# Altium schematic sheet FINAL_Prototype_Circuit.SchDoc
size A; SheetNumber: 2; SheetTotal: 2
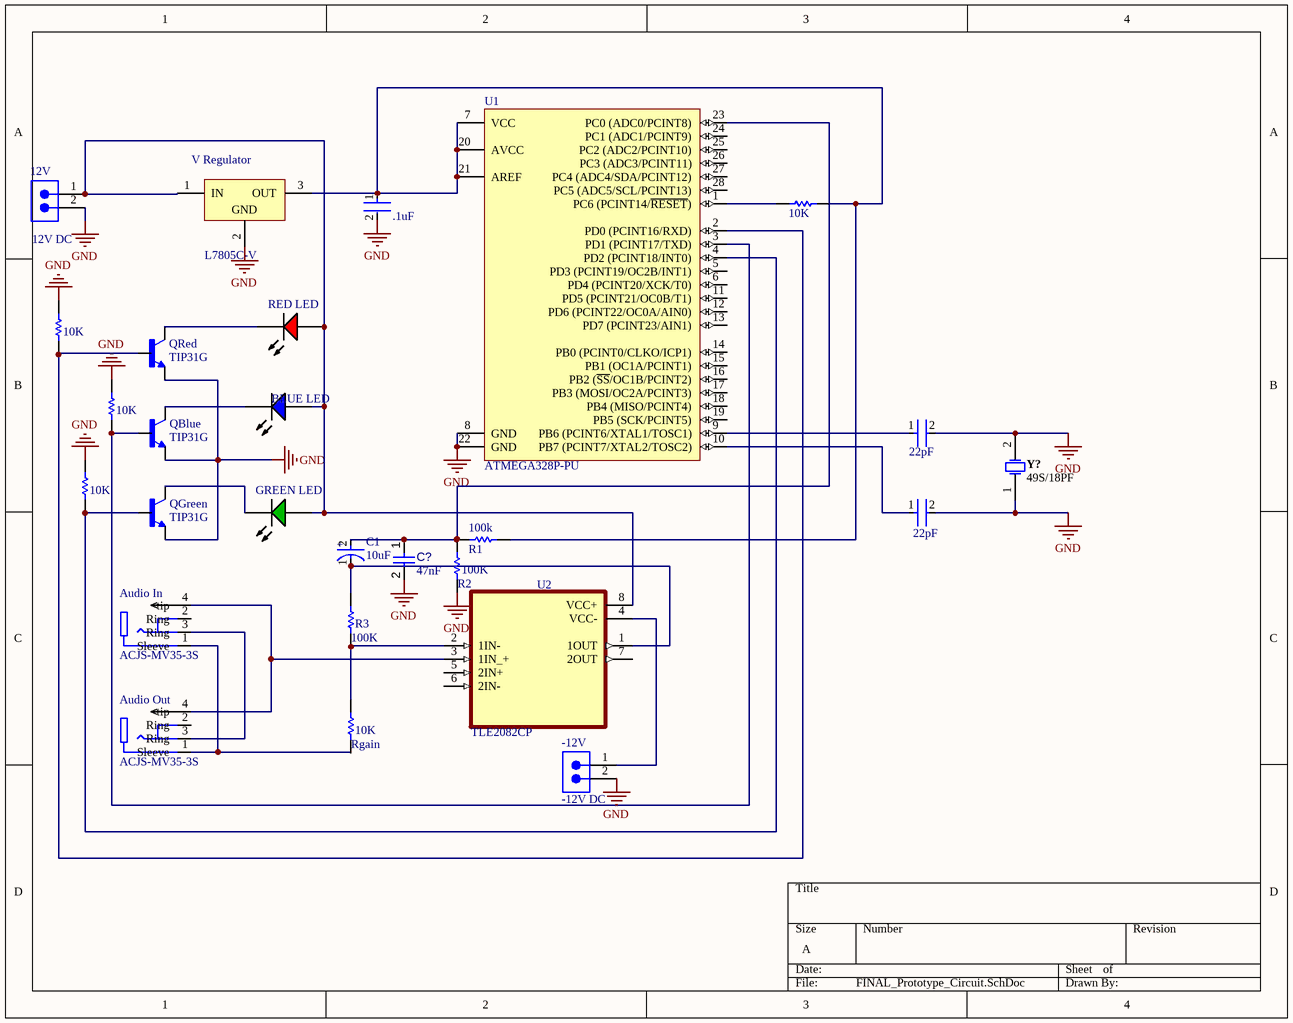
[diagram p0: FINAL_Prototype_Circuit.SchDoc]

## Parts
(Parts that share a designator on the sheet are numbered #1, #2 ... from top to bottom, then left to right.)
10K#1  100K +/-5%0805 125 mW  [RESC2013X70X40NL20T20]  (value not drawn)
10K#2  100K +/-5%0805 125 mW  [RESC2013X70X40NL20T20]  (value not drawn)
10K#3  100K +/-5%0805 125 mW  [RESC2013X70X40NL20T20]  (value not drawn)
10K#4  100K +/-5%0805 125 mW  [RESC2013X70X40NL20T20]  (value not drawn)
10K#5  Rgain  [RESC2013X70X40NL20T20]
12V  12V DC  [SMTC-TSW-102-26-XX-S]
22pF#1  0201ZC103KAT2A  [FP-0201-L_0_6_0_09-W_0_3-MFG]  (value not drawn)
22pF#2  0201ZC103KAT2A  [FP-0201-L_0_6_0_09-W_0_3-MFG]  (value not drawn)
100k#1  R1  [RESC2013X70X40NL20T20]
100K#2  R2  [RESC2013X70X40NL20T20]
-12V  -12V DC  [SMTC-TSW-102-26-XX-S]
.1uF  0201ZC103KAT2A  [FP-0201-L_0_6_0_09-W_0_3-MFG]  (value not drawn)
Audio_In  ACJS-MV35-3S  [AMPHENOL_ACJM-MV35-2S]
Audio_Out  ACJS-MV35-3S  [AMPHENOL_ACJM-MV35-2S]
BLUE_LED  19-217/BHC-ZL1M2RY/3T  [EVRL-0603-2_V]  (value not drawn)
C1  10uF  [FP-ECE-A1HN100U-MFG]
C?  value 47nF  [CAPC0402(1005)60_L]  (hidden comment: Capacitor 47nF +/-20% 50V 0402)
GREEN_LED  G502DC  [CGX-G502DC]  (value not drawn)
QBlue  TIP31G  [TO254P1060X482X2222-3]
QGreen  TIP31G  [TO254P1060X482X2222-3]
QRed  TIP31G  [TO254P1060X482X2222-3]
R3  100K  [RESC2013X70X40NL20T20]
RED_LED  19-217/R6C-AL1M2VY/3T  [EVRL-0603-2_V]  (value not drawn)
U1  ATMEGA328P-PU  [ATML-28P3]
U2  TLE2082CP  [DIP794W45P254L959H508Q8]
V_Regulator  L7805C-V  [TO220]
Y?  49S/18PF  [JPY-49S-18PF]

## Nets
GND: 10K#2.2 10K#3.2 12V.2 22pF#1.2 22pF#2.2 100K#2.1 -12V.2 .1uF.2 C?.2 QBlue.3(E) QGreen.3(E) QRed.3(E) U1.8(GND) U1.22(GND) V_Regulator.2(GND) Y?.1 Y?.2
Net10K#1_1: 10K#1.1 100k#1.1 .1uF.1 U1.7(VCC) U1.20(AVCC) U1.21(AREF) V_Regulator.3(OUT)
Net10K#1_2: 10K#1.2 U1.1(PC6_(PCINT14/~{RESET}))
Net10K#2_1: 10K#2.1 QRed.1(B) U1.2(PD0_(PCINT16/RXD))
Net10K#3_1: 10K#3.1 QBlue.1(B) U1.3(PD1_(PCINT17/TXD))
Net10K#4_1: 10K#4.1 QGreen.1(B) U1.4(PD2_(PCINT18/INT0))
Net10K#5_2: 10K#5.2 R3.1 U2.2(1IN-)
Net12V_1: 12V.1 BLUE_LED.1(A) GREEN_LED.1(A) RED_LED.1(A) U2.8(VCC+) V_Regulator.1(IN)
Net22pF#1_1: 22pF#1.1 U1.9(PB6_(PCINT6/XTAL1/TOSC1))
Net22pF#2_1: 22pF#2.1 U1.10(PB7_(PCINT7/XTAL2/TOSC2))
Net100k#1_2: 100k#1.2 100K#2.2 C1.2(A) C?.1 U1.23(PC0_(ADC0/PCINT8))
Net-12V_1: -12V.1 U2.4(VCC-)
NetAudio_In_1: Audio_In.1(Sleeve) Audio_Out.1(Sleeve)
NetAudio_In_3: Audio_In.3(Ring) Audio_Out.3(Ring)
NetAudio_In_4: Audio_In.4(tip) Audio_Out.4(tip) U2.3(1IN_+)
NetBLUE_LED_2: BLUE_LED.2(K) QBlue.2(C)
NetC1_1: C1.1(C) R3.2 U2.1(1OUT)
NetGREEN_LED_2: GREEN_LED.2(K) QGreen.2(C)
NetQRed_2: QRed.2(C) RED_LED.2(K)

Not connected (* = marked no-connect by the designer): 10K#4 2; 10K#5 1; Audio_In 2(Ring); Audio_Out 2(Ring); U1 5(PD3_(PCINT19/OC2B/INT1)) 6(PD4_(PCINT20/XCK/T0)) 11(PD5_(PCINT21/OC0B/T1)) 12(PD6_(PCINT22/OC0A/AIN0)) 13(PD7_(PCINT23/AIN1)) 14(PB0_(PCINT0/CLKO/ICP1)) 15(PB1_(OC1A/PCINT1)) 16(PB2_(~{SS}/OC1B/PCINT2)) 17(PB3_(MOSI/OC2A/PCINT3)) 18(PB4_(MISO/PCINT4)) 19(PB5_(SCK/PCINT5)) 24(PC1_(ADC1/PCINT9)) 25(PC2_(ADC2/PCINT10)) 26(PC3_(ADC3/PCINT11)) 27(PC4_(ADC4/SDA/PCINT12)) 28(PC5_(ADC5/SCL/PCINT13)); U2 5(2IN+) 6(2IN-) 7(2OUT)

## Notes on the sheet
- Labels drawn without touching a wire or pin: GND
- (in symbol CMP-05427-000036-1) +

## Library data of the parts
10K#1-10K#5 100k#1 100K#2 R3 = CMP-009-00201-1: Res Thick Film 0805 100K Ohm 5% 0.125W(1/8W) +/-200ppm/ßC SMD Automotive T/R; Voltage Rating (DC): 150V; Temperature Coefficient: 200ppm/°C; Resistance: 100kR; Power Rating: 125mW; Case/Package: 0805; Depth: 1.25mm; Width: 0.049inch; Termination: SMD/SMT; Series: ERJ; Length: 2mm; Construction: Rectangular; Size Code: 0805; Min Operating Temperature: -55°C; Features: Automotive AEC-Q200; Weight: 0.000194oz; Technology: THICK FILM; Number of Terminations: 2; Case Code (Metric): 2012; Max Operating Temperature: 155°C; REACH SVHC: No SVHC; Lead Free: Lead Free; Packaging: Tape and Reel; Case Code (Imperial): 0805; Mount: Surface Mount; Tolerance: 5%; Package Quantity: 5000; Voltage Rating: 150V; Max Power Dissipation: 125mW; Contact Plating: Tin; Height: 0.6mm; Resistor Type: Thick Film; RoHS Compliant: Yes; Radiation Hardening: No; Military Standard: Not; Resistance Tolerance: 5%
12V -12V = CMP-002-00085-1: Headers & Wire Housings Classic PCB Header Strips, 0.100 pitch; Pitch: 2.54mm; Max Current Rating: 7.6A; Number of Contacts: 2; Voltage Rating: 500V; Max Voltage Rating (AC): 550V; Contact Post Length: 3.2mm; Gender: Male; Housing Material: Polyester; Max Operating Temperature: 125°C; Orientation: Vertical; Package Quantity: 1; Contact Plating: Gold; REACH SVHC: No SVHC; Number of Rows: 1; Weight: 0.001257oz; Length: 5.08mm; Termination: Through Hole; Contact Material: Bronze; Contact Mating Length: 5.84mm; Contact Type: -; Contact Gender: Male; Depth: 2.54mm; RoHS Compliant: Yes; Radiation Hardening: No; Housing Color: Black; Number of Positions: 2; Min Operating Temperature: -55°C; Flammability Rating: UL94 V-0; Packaging: Bulk; Series: TSW
22pF#1 22pF#2 .1uF = CMP-001-00087-1: 0201 10 nF 10 V ±10 % Tolerance X7R Surface Mount Multilayer Ceramic Capacitor
Audio_In Audio_Out = CMP-00027-00002-2: Conn 3.5MM Audio Jack F 3 POS Solder ST Thru-Hole 4 Terminal 1 Port
BLUE_LED = CMP-007-00003-2: Chip LED, Blue, 5 V, 25 mA, -40 to 85 degC, 2-Pin SMD (0603), RoHS, Tape and Reel; Manufacturer: Everlight Electronics; Luminous Intensity: 28.5mcd; Viewing Angle: 120degrees; Forward Current: 25mA; Lens Style: Diffused; Forward Voltage: 3V; Pins: 2; Max Operating Temperature: 85°C; Manufacturer URL: http://www.everlight.com/; Datasheet URL: https://datasheet.ciiva.com/26901/getdatasheetpartid-420616-26901324.pdf; Package Reference: 0603; RoHS Compliant: True; Packaging: TapeandReel; Package Description: 2-Pin Surface Mount Device, Body 1.6 x 0.8 mm; Mounting Technology: SM; Datasheet Version: Rev. 1.0, 03/2003; Min Operating Temperature: -40°C; Case/Package: 0603; Colour: Blue
C1 = CMP-05427-000036-1: CAP ALUM 10UF 20% 50V RADIAL; Leakage Current: 4.5uA; Lead Diameter: 0.5mm; Polarity: Bipolar; Life (Hours): 2000Hour; Dissipation Factor: 0.15%; Ripple Current (AC): 50mA; Dielectric Material: Aluminium; Construction: RADIAL; Contact Plating: Tin; Lead Free: Lead Free; Number of Pins: 2; Height: 11.2mm; Lead Pitch: 2.5mm; Length: 11.2mm; Radiation Hardening: No; Package Quantity: 200; Diameter: 6.3mm; Capacitance: 10uF; Case/Package: Radial; Height - Seated (Max): 0.441inch; Voltage: 50V; Min Operating Temperature: -40°C; Tolerance: 20%; Voltage Rating (DC): 50V; Termination: Radial; Ripple Current: 50mA; Series: SU; REACH SVHC: No SVHC; Packaging: Bulk; Max Operating Temperature: 85°C; Voltage Rating: 50V; RoHS Compliant: Yes; Mount: Through Hole
C? = CMP-001-00071-4: Chip Capacitor, 47nF +/-20%, 50V, 0402, Thickness 0.6 mm; Tolerance: 20%; Pins: 2; Mounting Technology: SMT; Voltage Rating: 50V; Case/Package: 0402; Max Operating Temperature: 85°C; Min Operating Temperature: -55°C
GREEN_LED = CMP-007-00008-2: Green LED, 80 mW, 20 mA, -25 to 85 degC, 2-Pin THD; Manufacturer: Shenzhen CGX; Mounting Technology: TH; Package Reference: G502DC; Datasheet Version: Sep-14; Manufacturer URL: http://szcgx.com/; Package Description: 2-Pin Through Hole Device, Dia 5.9 mm; Datasheet URL: http://datasheet.octopart.com/G502DC-Chengguangxing-datasheet-62330340.pdf; Case/Package: G502DC; RoHS Compliant: Unknown
QBlue QGreen QRed = TIP31G: Bipolar (BJT) Transistor NPN 40 V 3 A 3MHz 2 W Through Hole TO-220; MF: ON Semiconductor; SnapEDA_Link: https://www.snapeda.com/parts/TIP31G/Onsemi/view-part/?ref=snap; Availability: In Stock; Purchase-URL: https://pricing.snapeda.com/search/part/TIP31G/?ref=eda; Check_prices: https://www.snapeda.com/parts/TIP31G/Onsemi/view-part/?ref=eda; Value: *; Package: TO-220-3 ON Semiconductor; MP: TIP31G; Price: None
RED_LED = CMP-007-00004-2: Chip LED, Red, 5 V, 25 mA, -40 to 85 degC, 2-Pin SMD (0603), RoHS, Tape and Reel; Manufacturer: Everlight Electronics; Forward Voltage: 2.2V; Lens Style: Clear; Package Reference: 0603; Datasheet Version: Rev. 1, 01/2005; Mounting Technology: SM; RoHS Compliant: False; Datasheet URL: https://datasheet.ciiva.com/4688/el-19-217-r6c-al1m2vy-3tpdf-187026-4688713.pdf; Case/Package: 0603; Colour: Red; Manufacturer URL: http://www.everlight.com/; Package Description: 2-Pin Surface Mount Device, Body 1.6 x 0.8 mm
U1 = CMP-020-00004-3: 8-Bit Microcontroller with 32 KBytes In-System Programmable Flash, 23 I/Os, -40 to 85 degC, 28-Pin PDIP (28P3), RoHS, Tube; Manufacturer: Atmel; I/Os: 23; Density: 32KB; Package Version: Rev. B, 09/2001; Max Clock Frequency: 20MHz; Interface: USART; Max Supply Voltage: 5.5V; Min Supply Voltage: 1.8V; Ethernet Channels: 0; RAM Size: 2KB; RoHS Compliant: True; Datasheet URL: http://www.atmel.com/images/Atmel-8271-8-bit-AVR-Microcontroller-ATmega48A-48PA-88A-88PA-168A-168PA-328-328P_datasheet_Complete.pdf; Packaging: Rail/Tube; Manufacturer URL: http://www.atmel.com/; Mounting Technology: TH; Package URL: http://www.atmel.com/images/Atmel-8271-8-bit-AVR-Microcontroller-ATmega48A-48PA-88A-88PA-168A-168PA-328-328P_datasheet_Complete.pdf; Datasheet Version: Rev. 8271J, 11/2015; Package Description: 28-Pin Plastic Dual Inline Package, Body 34.671 x 7.3025 mm, Pitch 2.54 mm; Package Quantity: 14; Min Operating Temperature: -40°C; Max Operating Temperature: 85°C; Case/Package: DIP; Pins: 28; Package Reference: 28P3
V_Regulator = CMP-019-00049-1: L7805 Series 5 V 1.5 A Fixed Flange Mount Voltage Regulator - TO-220-3; Number of Outputs: 1; Quiescent Current: 8mA; Polarity: Positive; Min Output Voltage: 5V; Max Input Voltage: 35V; Max Output Current: 1.5A; Tolerance: 5%; Min Input Voltage: 7V; Dropout Voltage: 2V; Power Supply Rejection Ratio (PSRR): 62dB; Min Operating Temperature: 0°C; Height: 9.15mm; Radiation Hardening: No; REACH SVHC: No SVHC; Length: 10.4mm; Number of Regulators: 1; Package Quantity: 1000; Number of Pins: 3; Mount: Through Hole; Max Operating Temperature: 125°C; Output Type: Fixed; Nominal Output Voltage: 5V; Weight: 0.08113oz; Series: -; RoHS Compliant: Yes; Output Configuration: Positive; Lead Free: Lead Free; Packaging: Rail/Tube; Output Voltage: 5V; Width: 4.6mm; Contact Plating: Gold; Output Current: 1.5A; Case/Package: TO
Y? = CMP-003-00000-2: Crystal, 16 MHz, +/-20 ppm, 18 pF, -20 to 70 degC, 2-Pin THD, RoHS; Manufacturer: Shenzhen Jingpengyuan; Frequency: 16MHz; Package Description: 2-Pin Through Hole Device, Body 11.05 x 4.65 mm, Pitch 4.88 mm; Mounting Technology: TH; Datasheet Version: Aug-14; Package Reference: 49S-18PF; RoHS Compliant: Unknown; Datasheet URL: http://datasheet.octopart.com/49S-18PF-Xinhunjing-datasheet-30677139.pdf; Case/Package: 49S-18PF; Manufacturer URL: http://www.chjiahui.com/
U2 = TLE2082CP: Package: None; Price: None; Value: *; MP: TLE2082CP; Availability: Unavailable